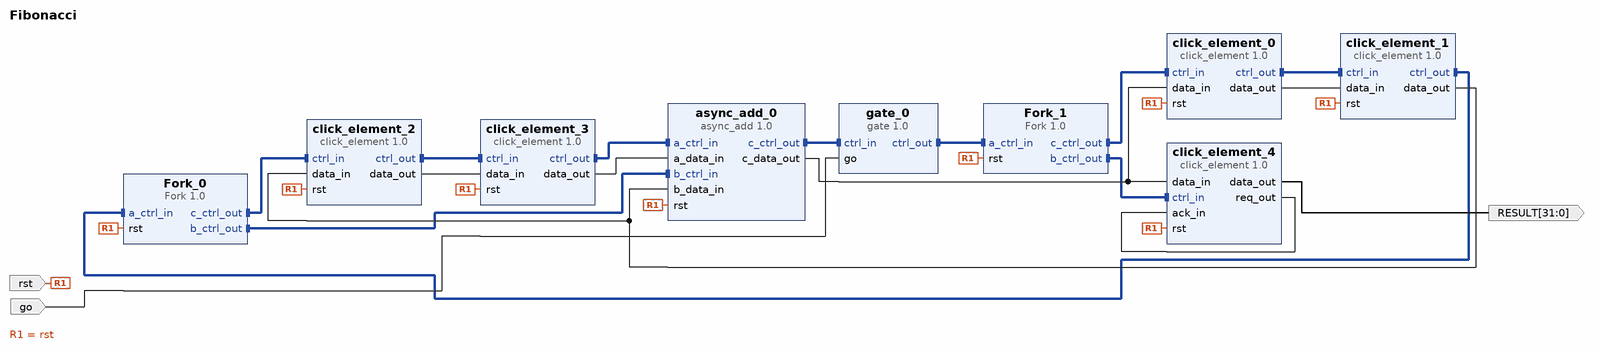
[diagram p0: block diagram of the top level]
# Vivado block design Fibonacci, xc7k70tfbv676-1, Vivado 2017.4
create_bd_design Fibonacci

create_bd_port -dir I rst
create_bd_port -dir I go
create_bd_port -dir O -from 31 -to 0 RESULT

create_bd_cell -type ip -vlnv xilinx.com:click_components:async_add:1.0 async_add_0
set_property -dict {CONFIG.PHASE_INIT {"1"}} [get_bd_cells async_add_0]
create_bd_cell -type ip -vlnv xilinx.com:click_components:click_element:1.0 click_element_0
create_bd_cell -type ip -vlnv xilinx.com:click_components:click_element:1.0 click_element_1
set_property -dict {CONFIG.VALUE 1} [get_bd_cells click_element_1]
create_bd_cell -type ip -vlnv xilinx.com:click_components:click_element:1.0 click_element_2
create_bd_cell -type ip -vlnv xilinx.com:click_components:click_element:1.0 click_element_3
create_bd_cell -type ip -vlnv xilinx.com:click_components:Fork:1.0 Fork_0
create_bd_cell -type ip -vlnv xilinx.com:click_components:Fork:1.0 Fork_1
create_bd_cell -type ip -vlnv xilinx.com:click_components:gate:1.0 gate_0
create_bd_cell -type ip -vlnv xilinx.com:click_components:click_element:1.0 click_element_4

# ---- connections ----

connect_bd_intf_net [get_bd_intf_pins click_element_0/ctrl_out] [get_bd_intf_pins click_element_1/ctrl_in]
connect_bd_intf_net [get_bd_intf_pins click_element_1/ctrl_out] [get_bd_intf_pins Fork_0/a_ctrl_in]
connect_bd_intf_net [get_bd_intf_pins Fork_0/b_ctrl_out] [get_bd_intf_pins async_add_0/b_ctrl_in]
connect_bd_intf_net [get_bd_intf_pins Fork_0/c_ctrl_out] [get_bd_intf_pins click_element_2/ctrl_in]
connect_bd_intf_net [get_bd_intf_pins click_element_2/ctrl_out] [get_bd_intf_pins click_element_3/ctrl_in]
connect_bd_intf_net [get_bd_intf_pins async_add_0/c_ctrl_out] [get_bd_intf_pins gate_0/ctrl_in]
connect_bd_intf_net [get_bd_intf_pins click_element_3/ctrl_out] [get_bd_intf_pins async_add_0/a_ctrl_in]
connect_bd_intf_net [get_bd_intf_pins Fork_1/a_ctrl_in] [get_bd_intf_pins gate_0/ctrl_out]
connect_bd_intf_net [get_bd_intf_pins Fork_1/c_ctrl_out] [get_bd_intf_pins click_element_0/ctrl_in]
connect_bd_intf_net [get_bd_intf_pins Fork_1/b_ctrl_out] [get_bd_intf_pins click_element_4/ctrl_in]
connect_bd_net [get_bd_pins click_element_2/data_out] [get_bd_pins click_element_3/data_in]
connect_bd_net [get_bd_pins click_element_3/data_out] [get_bd_pins async_add_0/a_data_in]
connect_bd_net [get_bd_pins click_element_1/data_out] [get_bd_pins async_add_0/b_data_in] [get_bd_pins click_element_2/data_in]
connect_bd_net [get_bd_pins click_element_0/data_out] [get_bd_pins click_element_1/data_in]
connect_bd_net [get_bd_pins async_add_0/c_data_out] [get_bd_pins click_element_0/data_in] [get_bd_pins click_element_4/data_in]
connect_bd_net [get_bd_pins click_element_4/req_out] [get_bd_pins click_element_4/ack_in]
connect_bd_net [get_bd_ports go] [get_bd_pins gate_0/go]
connect_bd_net [get_bd_ports rst] \
  [get_bd_pins click_element_3/rst] [get_bd_pins click_element_2/rst] [get_bd_pins Fork_0/rst] [get_bd_pins async_add_0/rst] \
  [get_bd_pins click_element_1/rst] [get_bd_pins click_element_0/rst] [get_bd_pins click_element_4/rst] \
  [get_bd_pins Fork_1/rst]
connect_bd_net [get_bd_pins click_element_4/data_out] [get_bd_ports RESULT]

validate_bd_design
save_bd_design
